# EAGLE design AC_nest (EAGLE 8.7.0)
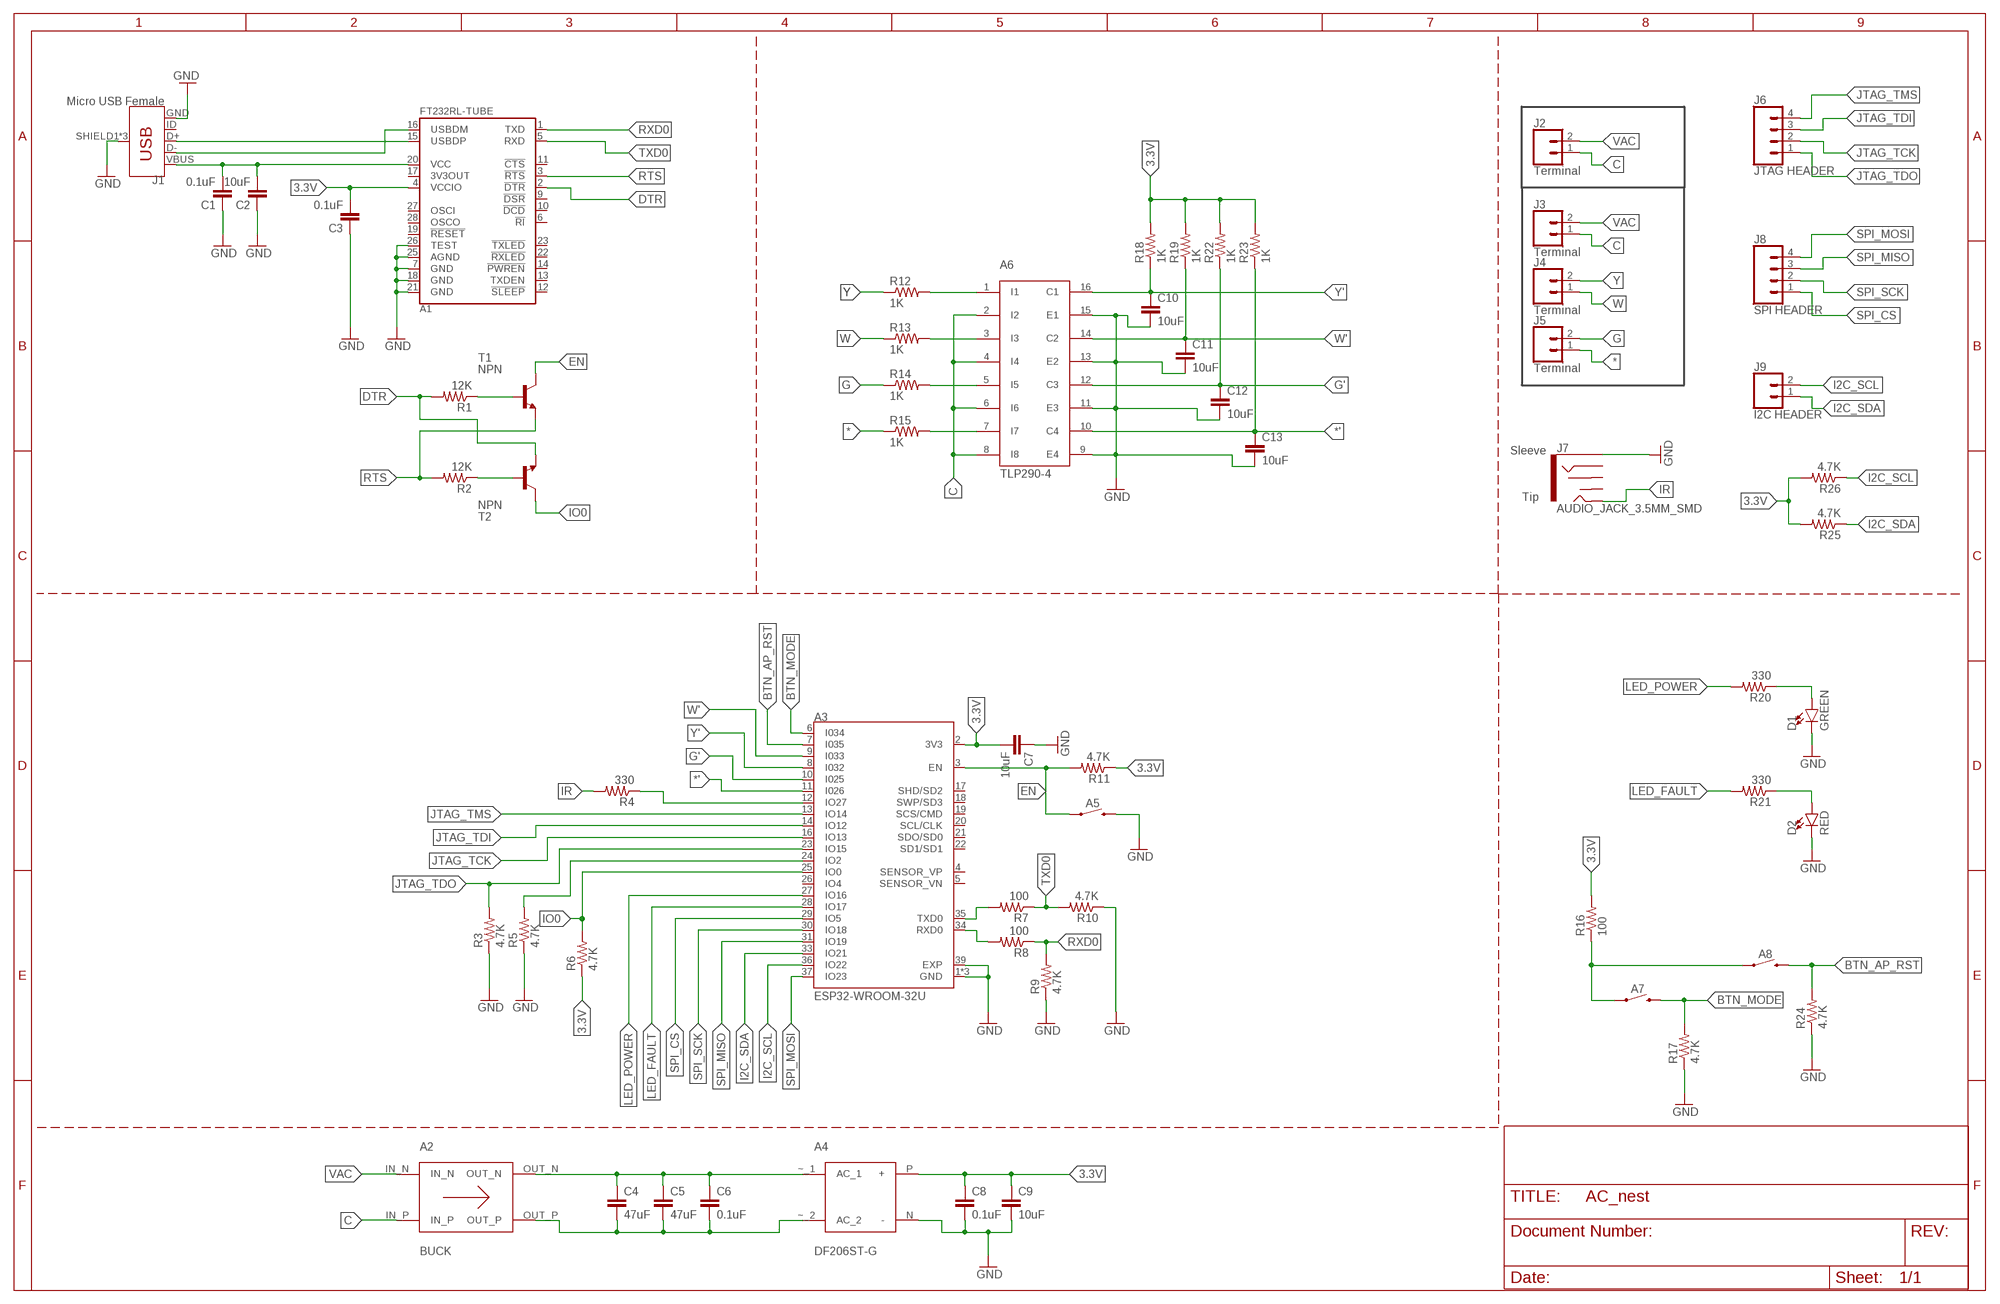
[diagram p0: schematic, sheet 1]

## Parts
A1  FT232RL  [SSOP28-LD]
A2  BUCK  [BUCK]
A3  ESP32-WROOM-32U  [XCVR_ESP32-WROOM-32U]
A4  DF206ST-G  [DF206ST-G]
A5  TL3302AF180QJ  [TL3302AF180QJ]
A6  TLP290-4  [TLP290-4]
A7  TL3302AF180QJ  [TL3302AF180QJ]
A8  TL3302AF180QJ  [TL3302AF180QJ]
C1  0.1uF  C-EUC0603  [C0603]
C2  10uF  C-EUC0603  [C0603]
C3  0.1uF  C-EUC0603  [C0603]
C4  47uF  C-EUC0603  [C0603]
C5  47uF  C-EUC0603  [C0603]
C6  0.1uF  C-EUC0603  [C0603]
C7  10uF  C-EUC0603  [C0603]
C8  0.1uF  C-EUC0603  [C0603]
C9  10uF  C-EUC0603  [C0603]
C10  10uF  C-EUC0603  [C0603]
C11  10uF  C-EUC0603  [C0603]
C12  10uF  C-EUC0603  [C0603]
C13  10uF  C-EUC0603  [C0603]
D1  GREEN  LED-GREEN0603  [LED-0603]
D2  RED  LED-RED0603  [LED-0603]
J1  Micro USB Female  USB_MICRO-B_FEMALE-SMT  [USB-B-MICRO-SMD]
J2  Terminal  CONN_023.5MM  [SCREWTERMINAL-3.5MM-2]
J3  Terminal  CONN_023.5MM  [SCREWTERMINAL-3.5MM-2]
J4  Terminal  CONN_023.5MM  [SCREWTERMINAL-3.5MM-2]
J5  Terminal  CONN_023.5MM  [SCREWTERMINAL-3.5MM-2]
J6  JTAG HEADER  CONN_04  [1X04]
J7  AUDIO_JACK_3.5MM_SMD  [AUDIO-JACK-3.5MM-SMD]
J8  SPI HEADER  CONN_04  [1X04]
J9  I2C HEADER  CONN_02  [1X02]
R1  12K  R-US_R0603  [R0603]
R2  12K  R-US_R0603  [R0603]
R3  4.7K  R-US_R0603  [R0603]
R4  330  R-US_R0603  [R0603]
R5  4.7K  R-US_R0603  [R0603]
R6  4.7K  R-US_R0603  [R0603]
R7  100  R-US_R0603  [R0603]
R8  100  R-US_R0603  [R0603]
R9  4.7K  R-US_R0603  [R0603]
R10  4.7K  R-US_R0603  [R0603]
R11  4.7K  R-US_R0603  [R0603]
R12  1K  R-US_R0603  [R0603]
R13  1K  R-US_R0603  [R0603]
R14  1K  R-US_R0603  [R0603]
R15  1K  R-US_R0603  [R0603]
R16  100  R-US_R0603  [R0603]
R17  4.7K  R-US_R0603  [R0603]
R18  1K  R-US_R0603  [R0603]
R19  1K  R-US_R0603  [R0603]
R20  330  R-US_R0603  [R0603]
R21  330  R-US_R0603  [R0603]
R22  1K  R-US_R0603  [R0603]
R23  1K  R-US_R0603  [R0603]
R24  4.7K  R-US_R0603  [R0603]
R25  4.7K  R-US_R0603  [R0603]
R26  4.7K  R-US_R0603  [R0603]
T1  NPN  -NPN-SOT23-EBC  [SOT23-EBC]
T2  NPN  -NPN-SOT23-EBC  [SOT23-EBC]

## Nets
3.3V: A1.4(VCCIO) A3.2(3V3) A4.P(+) C3.2 C7.2 C8.1 C9.1 R6.1 R11.1 R16.2 R18.2 R19.2 R22.2 R23.2 R25.2 R26.2
*: J5.1 R15.1
*': A3.11(I026) A6.10(C4) C13.1 R23.1
BTN_AP_RST: A3.7(I035) A8.2 R24.2
BTN_MODE: A3.6(I034) A7.2 R17.2
C: A2.IN_P A6.2(I2) A6.4(I4) A6.6(I6) A6.8(I8) J2.1 J3.1
DTR: A1.2(!DTR) R1.2 T2.E
EN: A3.3(EN) A5.1 R11.2 T1.C
G: J5.2 R14.1
G': A3.10(I025) A6.12(C3) C12.1 R22.1
GND: A1.7(GND) A1.18(GND) A1.21(GND) A1.25(AGND) A1.26(TEST) A3.1(GND) A3.15(GND) A3.38(GND) A3.39(EXP) A4.N(-) A5.2 A6.9(E4) A6.11(E3) A6.13(E2) A6.15(E1) C1.1 C2.1 C3.1 C7.1 C8.2 C9.2 C10.2 C11.2 C12.2 C13.2 D1.C D2.C J1.GND J1.SHIELD1(SHIELD) J1.SHIELD2(SHIELD) J1.SHIELD3(SHIELD) J7.SLEEVE R3.1 R5.1 R9.1 R10.1 R17.1 R24.1
I2C_SCL: A3.36(IO22) J9.2 R26.1
I2C_SDA: A3.33(IO21) J9.1 R25.1
IO0: A3.25(IO0) R6.2 T2.C
IR: J7.TIP R4.2
JTAG_TCK: A3.16(IO13) J6.2
JTAG_TDI: A3.14(IO12) J6.3
JTAG_TDO: A3.23(IO15) J6.1 R3.2
JTAG_TMS: A3.13(IO14) J6.4
LED_FAULT: A3.28(IO17) R21.2
LED_POWER: A3.27(IO16) R20.2
N$1: A6.1(I1) R12.2
N$2: A6.3(I3) R13.2
N$3: A6.5(I5) R14.2
N$4: A6.7(I7) R15.2
N$5: A3.34(RXD0) R8.2
N$6: A3.24(IO2) R5.2
N$7: A3.12(IO27) R4.1
N$8: A1.15(USBDP) J1.D+
N$10: A3.35(TXD0) R7.2
N$11: A1.16(USBDM) J1.D-
N$15: A2.OUT_N A4.~_1(AC_1) C4.1 C5.1 C6.1
N$16: R2.1 T2.B
N$17: A2.OUT_P A4.~_2(AC_2) C4.2 C5.2 C6.2
N$18: R1.1 T1.B
N$19: D1.A R20.1
N$21: D2.A R21.1
N$22: A7.1 A8.1 R16.1
RTS: A1.3(!RTS) R2.2 T1.E
RXD0: A1.1(TXD) R8.1 R9.2
SPI_CS: A3.29(IO5) J8.1
SPI_MISO: A3.31(IO19) J8.3
SPI_MOSI: A3.37(IO23) J8.4
SPI_SCK: A3.30(IO18) J8.2
TXD0: A1.5(RXD) R7.1 R10.2
USB_VBUS: A1.20(VCC) C1.2 C2.2 J1.VBUS
VAC: A2.IN_N J2.2 J3.2
W: J4.1 R13.1
W': A3.9(I033) A6.14(C2) C11.1 R19.1
Y: J4.2 R12.1
Y': A3.8(I032) A6.16(C1) C10.1 R18.1
Unconnected: A1.6(!RI) A1.9(!DSR) A1.10(!DCD) A1.11(!CTS) A1.12(!SLEEP) A1.13(TXDEN) A1.14(!PWREN) A1.19(!RESET) A1.22(!RXLED) A1.23(!TXLED) A1.27(OSCI) A1.28(OSCO) A3.4(SENSOR_VP) A3.5(SENSOR_VN) A3.17(SHD/SD2) A3.18(SWP/SD3) A3.19(SCS/CMD) A3.20(SCL/CLK) A3.21(SDO/SD0) A3.22(SD1/SD1) A3.26(IO4) J1.ID J7.RING J7.RSH J7.TSH

## Notes on the sheet
- Sleeve
- Tip

## Power pins joined to a net without a drawn wire
3V3OUT: A1.17(3V3OUT)

## Library data of the parts
A1 = AC_nest_parts:FT232RL; AVAILABILITY: Unavailable; DESCRIPTION: USB-to-UART 1-CH 256byte FIFO 5V 28-Pin SSOP Tube; MF: FTDI,; MP: FT232RL-TUBE; PACKAGE: SSOP-28 FTDI; PRICE: None
A2 = AC_nest_parts:BUCK
A3 = AC_nest_parts:ESP32-WROOM-32U: Wi-Fi/BT BLE Module ESP32-D0WD SPI Flash UART U.FL Conn.; AVAILABILITY: Unavailable; DESCRIPTION: Wi-Fi/BT BLE Module ESP32-D0WD SPI Flash UART U.FL Conn.; MF: Espressif Systems; MP: ESP32-WROOM-32U; PACKAGE: Module Espressif Systems; PRICE: None
A4 = AC_nest_parts:DF206ST-G
A5 A7 A8 = AC_nest_parts:TL3302AF180QJ
A6 = AC_nest_parts:TLP290-4: 4 Channel Optoisolator (AC/DC input)
C1-C13 = rcl:C-EU: CAPACITOR, European symbol; SPICEPREFIX: C
D1 = SparkFun-LED:LED-GREEN: Green SMD LED Used in manufacturing of various products at SparkFun Packages: 0603 - SMD 0603 package [Product Link] <http://www.futureelectronics.com/en/technologies/semiconductors/optoelectronics/leds/Pages/9894312-LTST-C190GKT.aspx?CrossPart=HSMG-C190&IM=0> LilyPad 1206 - SMD1206 LilyPad package [Product Link] <http://www.futureelectronics.com/en/Technologies/Product.aspx?ProductID=IN150NGHARVATEKCORPORATION2049943&IM=0> 1206 - SMD1206 package [Product Link] <http://www.futureelectronics.com/en/technologies/semiconductors/optoelectronics/leds/Pages/8315665-LTST-C150KGKT.aspx?IM=0> 1206 Bottom Mount -SMD 1206 Bottom Mount [Product Link] <http://www.digikey.com/product-detail/en/lite-on-inc/LTST-C230KGKT/160-1456-1-ND/386854> SparkFun Products: Pro Mini 328 -5V <https://www.sparkfun.com/products/821> RedBoard <https://www.sparkfun.com/products/12757> MP3 Trigger <https://www.sparkfun.com/products/13720> Makey Makey <https://www.sparkfun.com/products/11076>; PROD_ID: DIO-00821
D2 = SparkFun-LED:LED-RED: Red SMD LED Used in manufacturing of most products at SparkFun Packages: 0603 - SMD 0603 package [Product Link] <http://docs.avagotech.com/docs/AV02-0551EN> 0603 SMART - SMD 0603 SMART package ( more efficient and expensive)[Product Link] <http://www.osram-os.com/Graphics/XPic2/00077099_0.pdf> 1206 - SMD1206 package [Product Link] <https://www.sparkfun.com/datasheets/DevTools/LilyPad/Q150OVS4.pdff> SparkFun Products: Pro Mini 328 -5V <https://www.sparkfun.com/products/821> RedBoard <https://www.sparkfun.com/products/12757> IOIO-OTG <https://www.sparkfun.com/products/13613>; PROD_ID: DIO-00819
J1 = SparkFun-Connectors:USB_MICRO-B: USB Type Micro-B Connector Male/female and PTH/SMT variants SparkFun Products: SparkFun microB USB Breakout <https://www.sparkfun.com/products/12035> SparkFun USB microB Plug Breakout <https://www.sparkfun.com/products/10031> SparkFun ESP8266 Thing <https://www.sparkfun.com/products/13231>; PROD_ID: CONN-11752
J2-J5 = SparkFun-Connectors:CONN_02: Multi connection point. Often used as Generic Header-pin footprint for 0.1 inch spaced/style header connections On any of the 0.1 inch spaced packages, you can populate with these: Break Away Headers - Straight <https://www.sparkfun.com/products/116> (PRT-00116) Break Away Male Headers - Right Angle <https://www.sparkfun.com/products/553> (PRT-00553) Female Headers <https://www.sparkfun.com/products/115> (PRT-00115) Break Away Headers - Machine Pin <https://www.sparkfun.com/products/117> (PRT-00117) Break Away Female Headers - Swiss Machine Pin <https://www.sparkfun.com/products/743> (PRT-00743) For SCREWTERMINALS and SPRING TERMINALS visit here: Screw Terimnals on SparkFun.com <https://www.sparkfun.com/search/results?term=Screw+Terminals> (5mm/3.5mm/2.54mm spacing) This device is also useful as a general connection point to wire up your design to another part of your project. Our various solder wires solder well into these plated through hole pads. Hook-Up Wire - Assortment (Stranded, 22 AWG) <https://www.sparkfun.com/products/11375> (PRT-11375) Hook-Up Wire - Assortment (Solid Core, 22 AWG) <https://www.sparkfun.com/products/11367> (PRT-11367) View the entire wire category on our website here <https://www.sparkfun.com/categories/141> Special notes: Molex polarized connector foot print use with: PRT-08233 with associated crimp pins and housings. 2.54_SCREWTERM for use with PRT-10571. 3.5mm Screw Terminal footprints for PRT-08084 5mm Screw Terminal footprints for use with PRT-08432; PROD_ID: CONN-08399
J6 J8 = SparkFun-Connectors:CONN_04: Multi connection point. Often used as Generic Header-pin footprint for 0.1 inch spaced/style header connections On any of the 0.1 inch spaced packages, you can populate with these: Break Away Headers - Straight <https://www.sparkfun.com/products/116> (PRT-00116) Break Away Male Headers - Right Angle <https://www.sparkfun.com/products/553> (PRT-00553) Female Headers <https://www.sparkfun.com/products/115> (PRT-00115) Break Away Headers - Machine Pin <https://www.sparkfun.com/products/117> (PRT-00117) Break Away Female Headers - Swiss Machine Pin <https://www.sparkfun.com/products/743> (PRT-00743) For SCREWTERMINALS and SPRING TERMINALS visit here: Screw Terimnals on SparkFun.com <https://www.sparkfun.com/search/results?term=Screw+Terminals> (5mm/3.5mm/2.54mm spacing) This device is also useful as a general connection point to wire up your design to another part of your project. Our various solder wires solder well into these plated through hole pads. Hook-Up Wire - Assortment (Stranded, 22 AWG) <https://www.sparkfun.com/products/11375> (PRT-11375) Hook-Up Wire - Assortment (Solid Core, 22 AWG) <https://www.sparkfun.com/products/11367> (PRT-11367) View the entire wire category on our website here <https://www.sparkfun.com/categories/141> Special notes: Molex polarized connector foot print use with SKU : PRT-08231 with associated crimp pins and housings. 1MM SMD Version SKU: PRT-10208; PROD_ID: CONN-09696
J7 = SparkFun-Connectors:AUDIO_JACK_3.5MM: Audio Jack 3.5mm variants of PTH and SMT stereo audio jack with bypass switches. SparkFun Products: SparkFun SparkPunk Sound Kit <[https://www.sparkfun.com/products/11177]> - PTH MP3 Trigger <https://www.sparkfun.com/products/13720> -3.5mm SMD SparkFun PicoBoard <https://www.sparkfun.com/products/11888>- 2.5mm SMD; PROD_ID: CONN-10353
J9 = SparkFun-Connectors:CONN_02: Multi connection point. Often used as Generic Header-pin footprint for 0.1 inch spaced/style header connections On any of the 0.1 inch spaced packages, you can populate with these: Break Away Headers - Straight <https://www.sparkfun.com/products/116> (PRT-00116) Break Away Male Headers - Right Angle <https://www.sparkfun.com/products/553> (PRT-00553) Female Headers <https://www.sparkfun.com/products/115> (PRT-00115) Break Away Headers - Machine Pin <https://www.sparkfun.com/products/117> (PRT-00117) Break Away Female Headers - Swiss Machine Pin <https://www.sparkfun.com/products/743> (PRT-00743) For SCREWTERMINALS and SPRING TERMINALS visit here: Screw Terimnals on SparkFun.com <https://www.sparkfun.com/search/results?term=Screw+Terminals> (5mm/3.5mm/2.54mm spacing) This device is also useful as a general connection point to wire up your design to another part of your project. Our various solder wires solder well into these plated through hole pads. Hook-Up Wire - Assortment (Stranded, 22 AWG) <https://www.sparkfun.com/products/11375> (PRT-11375) Hook-Up Wire - Assortment (Solid Core, 22 AWG) <https://www.sparkfun.com/products/11367> (PRT-11367) View the entire wire category on our website here <https://www.sparkfun.com/categories/141> Special notes: Molex polarized connector foot print use with: PRT-08233 with associated crimp pins and housings. 2.54_SCREWTERM for use with PRT-10571. 3.5mm Screw Terminal footprints for PRT-08084 5mm Screw Terminal footprints for use with PRT-08432
R1-R26 = rcl:R-US_: RESISTOR, American symbol; SPICEPREFIX: R
T1 T2 = transistor:*-NPN-: NPN Transistror BF959 corrected 2008.03.06

## Board
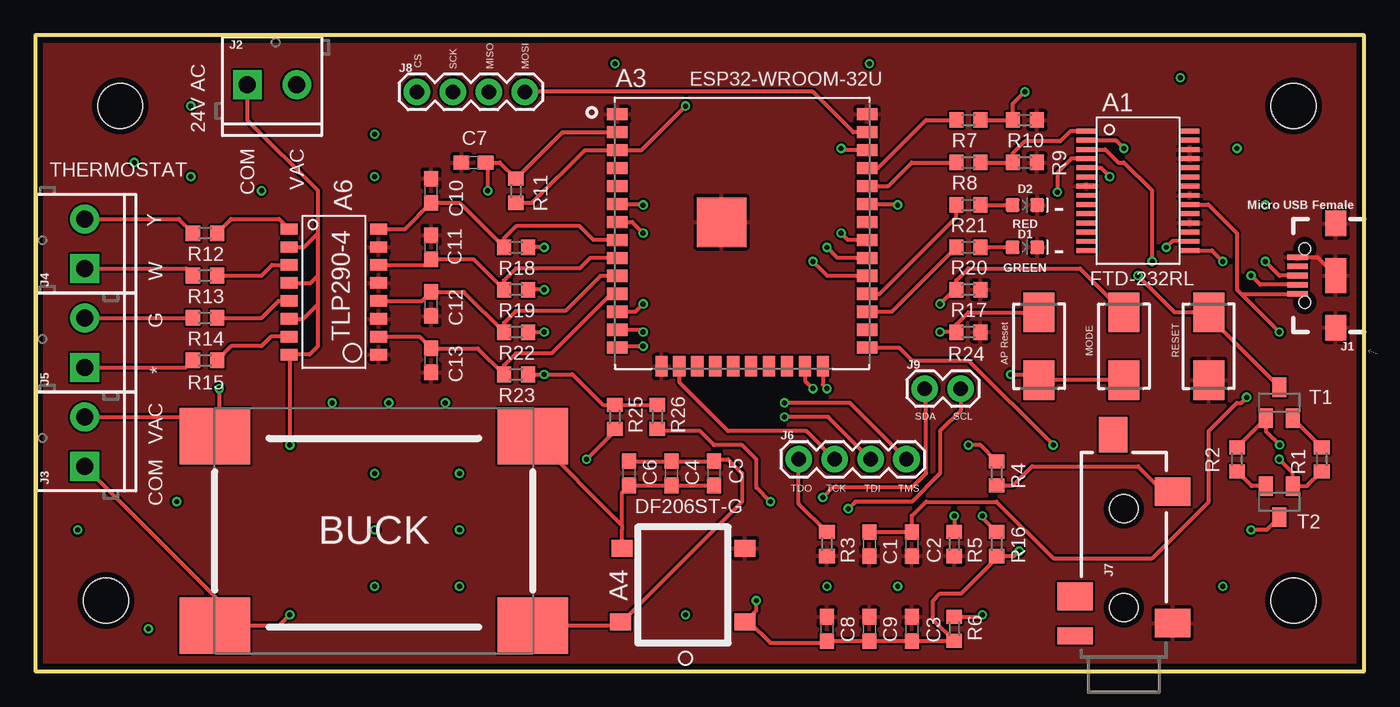
[diagram p1: board, top side]
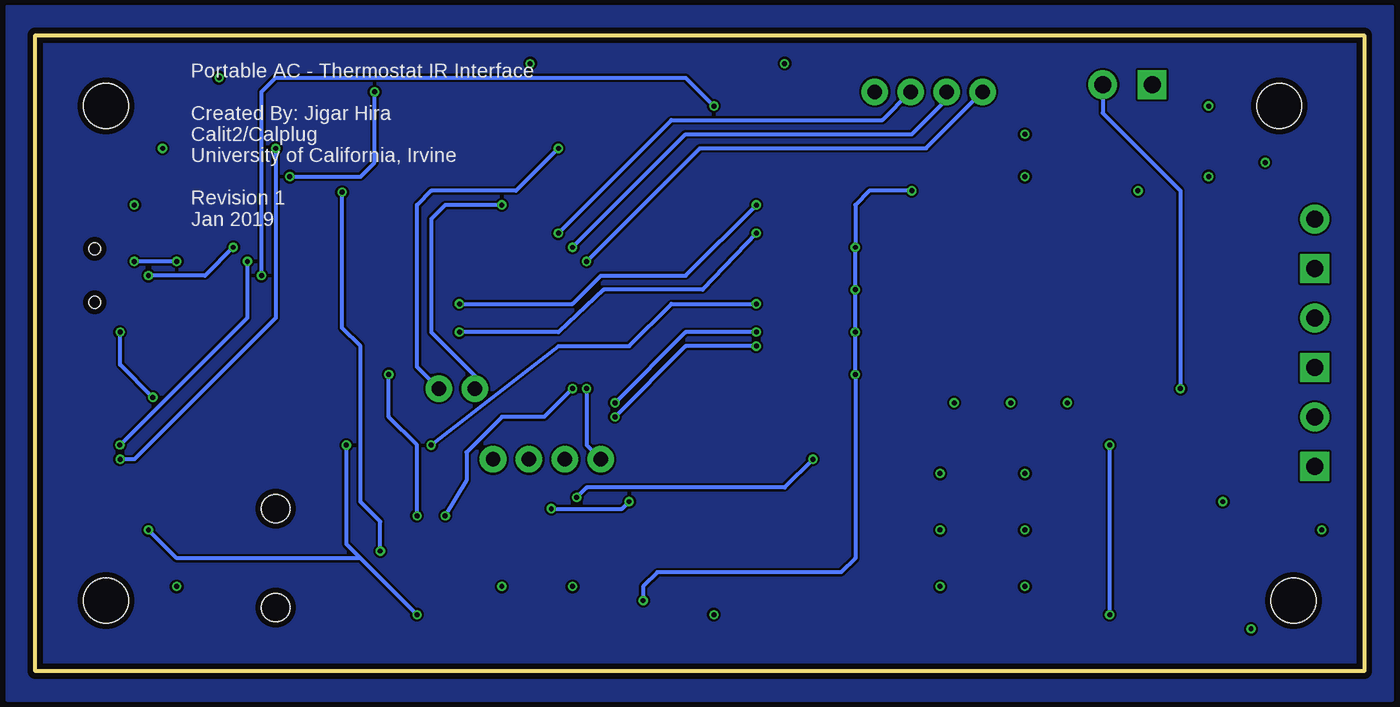
[diagram p2: board, bottom side, seen from below]

Size 94 x 45 mm. Coordinates in mm from the lower left corner, seen from the top.
Outline: 0,0 94,0 94,45 0,45 0,0
Copper layers (1*16): Top 0.035mm / dielectric 1.5mm / Bottom 0.035mm
Design rules "NOA Eagle Rule 2016-06-12": minimum track width 6mil, minimum drill 0.3mm, track to track 6mil, track to pad 6mil, pad to pad 6mil, via to via 6mil, smd to smd 0mil, copper to edge 0.4mm, drill to drill 10mil, minimum pad ring 10mil, minimum via ring 6mil, stop-mask expansion 2mil, vias tented up to drill 25mil, thermal gap 10mil
Holes 3.17 mm at 6,40 89,40 89,5 5,5

### Footprints (pad centres in the part's own frame; a part is rotated, then mirrored left to right if it is on the bottom)
SSOP28-LD = smd 0.348 x 1.397: 1 -4.225,-3.656; 2 -3.575,-3.656; 3 -2.925,-3.656; 4 -2.275,-3.656; 5 -1.625,-3.656; 6 -0.975,-3.656; 7 -0.325,-3.656; 8 0.325,-3.656; 9 0.975,-3.656; 10 1.625,-3.656; 11 2.275,-3.656; 12 2.925,-3.656; 13 3.575,-3.656; 14 4.225,-3.656; 15 4.225,3.656; 16 3.575,3.656; 17 2.925,3.656; 18 2.275,3.656; 19 1.625,3.656; 20 0.975,3.656; 21 0.325,3.656; 22 -0.325,3.656; 23 -0.975,3.656; 24 -1.625,3.656; 25 -2.275,3.656; 26 -2.925,3.656; 27 -3.575,3.656; 28 -4.225,3.656
BUCK = smd 5 x 4: IN_N -11.303,6.637; IN_P -11.303,-6.763; OUT_N 11.197,6.637; OUT_P 11.197,-6.763
XCVR_ESP32-WROOM-32U = smd 1.45 x 0.86: 1 -8.83,8.41; 2 -8.83,7.14; 3 -8.83,5.87; 4 -8.83,4.6; 5 -8.83,3.33; 6 -8.83,2.06; 7 -8.83,0.79; 8 -8.83,-0.48; 9 -8.83,-1.75; 10 -8.83,-3.02; 11 -8.83,-4.29; 12 -8.83,-5.56; 13 -8.83,-6.83; 14 -8.83,-8.1; 25 8.83,-8.1; 26 8.83,-6.83; 27 8.83,-5.56; 28 8.83,-4.29; 29 8.83,-3.02; 30 8.83,-1.75; 31 8.83,-0.48; 32 8.83,0.79; 33 8.83,2.06; 34 8.83,3.33; 35 8.83,4.6; 36 8.83,5.87; 37 8.83,7.14; 38 8.83,8.41 | smd 0.86 x 1.45: 15 -5.715,-9.43; 16 -4.445,-9.43; 17 -3.175,-9.43; 18 -1.905,-9.43; 19 -0.635,-9.43; 20 0.635,-9.43; 21 1.905,-9.43; 22 3.175,-9.43; 23 4.445,-9.43; 24 5.715,-9.43 | smd 3.5 x 3.5: 39 -1.46,0.77
DF206ST-G = smd 1.2 x 1.5: N -2.7,4.2; P 2.5,4.2; ~_1 -2.7,-4.5; ~_2 2.5,-4.6
TL3302AF180QJ = smd 2.8 x 2.2: 1 -2.4,0; 2 2.4,0
TLP290-4 = smd 0.8 x 1.2: 1 0,-7.62; 2 1.27,-7.62; 3 2.54,-7.62; 4 3.81,-7.62; 5 5.08,-7.62; 6 6.35,-7.62; 7 7.62,-7.62; 8 8.89,-7.62; 9 8.89,-1.27; 10 7.62,-1.27; 11 6.35,-1.27; 12 5.08,-1.27; 13 3.81,-1.27; 14 2.54,-1.27; 15 1.27,-1.27; 16 0,-1.27
C0603 = smd 1.1 x 1: 1 -0.85,0; 2 0.85,0
LED-0603 = smd 1 x 1: A -0.877,0; C 0.877,0
USB-B-MICRO-SMD = smd 1.45 x 0.4: D+ 2.725,0; D- 2.725,0.65; GND 2.725,-1.3; ID 2.725,-0.65; VBUS 2.725,1.3 | smd 1.5 x 1.8: SHIELD1 0,3.685; SHIELD2 0,-3.685 | smd 1.5 x 2.5: SHIELD3 0,0 | hole 0.85: 2.2,1.9; 2.2,-1.9
SCREWTERMINAL-3.5MM-2 = drill 1.2 pad 2.032 square: 1 0,0 | drill 1.2 pad 2.032: 2 3.5,0
1X04 = drill 1.016 pad 1.88: 1 0,0; 2 2.54,0; 3 5.08,0; 4 7.62,0
AUDIO-JACK-3.5MM-SMD = smd 2 x 2.5: RING 4.3,3.45; SLEEVE 2.4,-3.45; TIP 11.7,-3.45 | smd 1.2 x 2.5: RSH 1.5,3.45 | smd 2.5 x 2: TSH 15.75,0.75 | hole 2: 3.5,0; 10.5,0
1X02 = drill 1.016 pad 1.88: 1 0,0; 2 2.54,0
R0603 = smd 1 x 1.1: 1 -0.85,0; 2 0.85,0
SOT23-EBC = smd 1 x 1.4: B 0.95,-1.1; C 0,1.1; E -0.95,-1.1

### Placement (x,y rotation side)
A1  78,34 270 top
A2  24,10 0 top
A3  50,31 0 top
A4  46,6 270 top
A5  83,23 270 top
A6  25.56,31.29 270 top
A7  77,23 90 top
A8  71,23 90 top
C1  59,9 90 top
C2  62,9 90 top
C3  62,3 270 top
C4  45,14 90 top
C5  48,14 90 top
C6  42,14 90 top
C7  31,36 0 top
C8  56,3 90 top
C9  59,3 90 top
C10  28,34 90 top
C11  28,30 90 top
C12  28,26 270 top
C13  28,22 270 top
D1  70,30 0 top
D2  70,33 0 top
J1  92,28 180 top
J2  15,41.5 0 top
J3  3.5,14.5 90 top
J4  3.5,28.5 90 top
J5  3.5,21.5 90 top
J6  54,15 0 top
J7  77,1 90 top
J8  27,41 0 top
J9  62.92,20 0 top
R1  91,15 270 top
R2  85,15 90 top
R3  56,9 90 top
R4  68,14 270 top
R5  65,9 90 top
R6  65,3 90 top
R7  66,39 180 top
R8  66,36 180 top
R9  70,36 180 top
R10  70,39 180 top
R11  34,34 270 top
R12  12,31 0 top
R13  12,28 0 top
R14  12,25 0 top
R15  12,22 0 top
R16  68,9 270 top
R17  66,27 180 top
R18  34,30 0 top
R19  34,27 0 top
R20  66,30 180 top
R21  66,33 180 top
R22  34,24 0 top
R23  34,21 0 top
R24  66,24 180 top
R25  41,18 90 top
R26  44,18 90 top
T1  88,19 0 top
T2  88,12 180 top

### Tracks (layer width: path | path; a pad name or v marks a point on that pad's centre or on a via)
3.3V  (via drill 0.35)
  Top 0.3: A3.2 37.29,38.14 R11.1 32.85,36 C7.2 32,35.85 v32,34 | 34.87,24.02 R22.2 v36,24 | R23.2 v36,21 38,21 40.15,18.85 R25.2 R26.2 | v36,27 R19.2 | v36,30 R18.2 | v51,5 51,4.3 A4.P 50.5,3.5 52,2 55.85,2 C8.1 C9.1 C3.2 R6.1 63.5,3.65 63.5,5 64,5.5 65.5,5.5 68,8 R16.2 69.25,8.15 v69.6,8.5 | A1.4 73.28,36.27 72.3,35.3 v72.3,33.9
  Bottom 0.3: v32,34 35,34 36,33 v36,30 v36,27 v36,24 v36,21 36,8 37,7 50,7 51,6 v51,5 | v69.6,8.5 69.6,10.6 71,12 71,23 72.3,24.3 v72.3,33.9
*
  Top 0.3: J5.1 10.65,21.5 R15.1
*'
  Top 0.3: A6.10 27.18,23.67 C13.1 31.3,22.85 R23.1 33.15,21.65 34,22.5 36.5,22.5 40.71,26.71 A3.11
BTN_AP_RST  (via drill 0.35)
  Top 0.3: A8.2 66,25.4 65.15,24.55 R24.2 v64,24 | A3.7 42.21,31.79 v43,31
  Bottom 0.3: v43,31 46.8,27 53.8,27 57,24 v64,24
BTN_MODE  (via drill 0.35)
  Top 0.3: A7.2 73.9,28.5 66,28.5 65.15,27.65 R17.2 65,27 v64,26 | A3.6 42.94,33.06 v43,33
  Bottom 0.3: v64,26 56,26 54,28 48,28 v43,33
C  (via drill 0.35)
  Top 0.3: J2.1 15,39 20,34 20,31 | 20,26 20,23 19.4,22.4 A6.8 18,22.34 v18,16 | 20,26 20,28 | 20,28 20,31 | A6.6 18.94,24.94 20,26 | A6.4 19.48,27.48 20,28 | A6.2 19.02,30.02 20,31 | v18,4 17.24,3.24 A2.IN_P 13,3.54 13,5 J3.1
  Bottom 0.3: v18,4 v18,16
DTR  (via drill 0.35)
  Top 0.3: R1.2 89.95,13.1 T2.E 88.95,14.05 v88,15 | A1.2 76.42,37.58 v77,37
  Bottom 0.3: v77,37 77,25 87,15 v88,15
EN  (via drill 0.35)
  Top 0.3: R11.2 35.15,33.15 38.87,36.87 A3.3 42.87,36.87 v46,40 | T1.C 83,25.1 A5.1 80.6,25.4 v78,28
  Bottom 0.3: v46,40 48,42 70,42 77,42 78,41 v78,28
G
  Top 0.3: J5.2 R14.1
G'
  Top 0.3: A6.12 27.36,26.21 C12.1 30.3,26.85 R22.1 33.15,24.65 34,25.5 37.5,25.5 39.98,27.98 A3.10
GND
  Top 0.3: J1.GND 90.7,29.3 J1.SHIELD3
  pour Top: -1,46 95,46 95,-1 -1,-1
  pour Bottom: -2,47 96,47 96,-1 96,-2 -2,-2
I2C_SCL  (via drill 0.35)
  Top 0.3: 58.96,37 A3.36 57.13,36.87 v57,37 | J9.2 65.46,18.46 64,17 64,14 62,12 58,12 v57.5,11.5 | v52,12 51,13 51,15 50,16 48,16 47,17 44.15,17 R26.1
  Bottom 0.3: J9.2 67,21.54 67,33 66,34 60,34 v57,37 | v57.5,11.5 52.5,11.5 v52,12
I2C_SDA  (via drill 0.35)
  Top 0.3: A3.33 60.94,33.06 v61,33 | R25.1 41,17 v39,15 | J9.1 63,19.92 63,14 62,13 56.4,13 v55.7,12.3
  Bottom 0.3: v61,33 65,33 66,32 66,24 62.92,20.92 J9.1 | v39,15 41,13 55,13 v55.7,12.3
IO0  (via drill 0.35)
  Top 0.3: R6.2 66.85,3.85 v67,4 | T2.C 87.1,10 v86,10 | A3.25 61.1,22.9 62,22 66,22 v72,16
  Bottom 0.3: v67,4 71,8 | 71,8 84,8 v86,10 | v72,16 72,9 71,8
IR
  Top 0.3: R4.2 69.15,13.15 70.5,14.5 78,14.5 79.8,12.7 J7.TIP
JTAG_TCK
  Top 0.3: J6.2 54.54,17 49,17 45.55,20.45 A3.16
JTAG_TDI  (via drill 0.35)
  Top 0.3: J6.3 56.08,18 v53,18 | A3.14 41.27,23 v43,23
  Bottom 0.3: v43,23 48,23 v53,18
JTAG_TDO  (via drill 0.35)
  Top 0.3: R3.2 54,11.85 J6.1 | A3.23 54.45,20.55 v55,20
  Bottom 0.3: v55,20 55,16 J6.1
JTAG_TMS  (via drill 0.35)
  Top 0.3: J6.4 57.62,19 v53,19 | A3.13 42.83,24.17 v43,24
  Bottom 0.3: v43,24 48,24 v53,19
LED_FAULT
  Top 0.3: A3.28 59.71,26.71 65.15,32.15 R21.2
LED_POWER
  Top 0.3: A3.27 60.59,25.44 R20.2
N$1
  Top 0.3: R12.2 13.85,32 17.23,32 A6.1
N$2
  Top 0.3: R13.2 16,28 16.75,28.75 A6.3
N$3
  Top 0.3: R14.2 16,25 17.21,26.21 A6.5
N$4
  Top 0.3: R15.2 13.85,23 16,23 16.67,23.67 A6.7
N$5
  Top 0.3: A3.34 60.33,34.33 62,36 R8.2
N$6  (via drill 0.35)
  Top 0.3: A3.24 55.72,20.29 v56,20 | v65,11 R5.2
  Bottom 0.3: v56,20 58,18 61,18 63.5,15.5 63.5,13.5 v65,11
N$7  (via drill 0.35)
  Top 0.3: A3.12 42.44,25.44 v43,26 | R4.1 66.85,16 v66,16
  Bottom 0.3: v66,16 57,23 52,23 49,26 v43,26
N$8  (via drill 0.35)
  Top 0.3: J1.D+ 88,28 v87,29 | A1.15 83.22,29.77 v84,29
  Bottom 0.3: v84,29 v87,29
N$9  (via drill 0.35)
  other vias: 24,14
N$10
  Top 0.3: A3.35 59.6,35.6 63,39 R7.2
N$11  (via drill 0.35)
  Top 0.3: J1.D- 86.65,27.35 v86,28 | A1.16 80.42,30.43 v80,30
  Bottom 0.3: v80,30 82,28 v86,28
N$12  (via drill 0.35)
  other vias: 30,14
N$13  (via drill 0.35)
  other vias: 30,6
N$14  (via drill 0.35)
  other vias: 24,6
N$15
  Top 0.3: C5.1 C4.1 C6.1 41.5,12.65 41.5,10.33 | A4.~_1 41.5,10 41.5,10.33 | A2.OUT_N 41.5,10.33
N$16
  Top 0.3: T2.B 86.05,13.1 R2.1
N$17
  Top 0.3: C6.2 C4.2 C5.2 48.15,15 49,15 50,14 50,12 41.5,3.5 A4.~_2 41.14,3.24 A2.OUT_P
N$18
  Top 0.3: R1.1 T1.B
N$19
  Top 0.3: R20.1 D1.A
N$20  (via drill 0.35)
  other vias: 30,10
N$21
  Top 0.3: R21.1 D2.A
N$22  (via drill 0.35)
  Top 0.3: A7.1 A8.1 70.6,21 v69,21 | R16.1 67,10.85 v67,11
  Bottom 0.3: v67,11 67,16 69,18 v69,21
N$23  (via drill 0.35)
  other vias: 24,10
N$24  (via drill 0.35)
  other vias: 87,33
N$25  (via drill 0.35)
  other vias: 85,37
N$26  (via drill 0.35)
  other vias: 81,42
N$27  (via drill 0.35)
  other vias: 84,6
N$28  (via drill 0.35)
  other vias: 3,10
N$29  (via drill 0.35)
  other vias: 10,12
N$30  (via drill 0.35)
  other vias: 8,3
N$31  (via drill 0.35)
  other vias: 11,35
N$32  (via drill 0.35)
  other vias: 11,40
N$33  (via drill 0.35)
  other vias: 7,36
N$34  (via drill 0.35)
  other vias: 21,19
N$35  (via drill 0.35)
  other vias: 25,19
N$36  (via drill 0.35)
  other vias: 29,19
N$37  (via drill 0.35)
  other vias: 24,38
N$38  (via drill 0.35)
  other vias: 24,35
N$39  (via drill 0.35)
  other vias: 16,34
N$40  (via drill 0.35)
  other vias: 41,43
N$41  (via drill 0.35)
  other vias: 59,43
N$42  (via drill 0.35)
  other vias: 56,6
N$43  (via drill 0.35)
  other vias: 61,6
N$44  (via drill 0.35)
  other vias: 46,4
RTS  (via drill 0.35)
  Top 0.3: R2.2 T1.E 87.05,16.98 v88.02,16.02 | v79,29 79,34 77,36 76.6,36 75.67,36.92 A1.3
  Bottom 0.3: v79,29 79,26.03 79,25 87.98,16.02 v88.02,16.02
RXD0
  Top 0.3: R8.1 R9.2 69.15,36.65 70,37.5 72.5,37.5 73.22,38.23 A1.1
SPI_CS  (via drill 0.35)
  Top 0.3: A3.29 56.02,27.98 v55,29
  Bottom 0.3: v55,29 47,37 31,37 J8.1
SPI_MISO  (via drill 0.35)
  Top 0.3: A3.31 57.48,30.52 v57,31
  Bottom 0.3: v57,31 49,39 34.08,39 J8.3
SPI_MOSI
  Top 0.3: A3.37 57.86,38.14 55,41 J8.4
SPI_SCK  (via drill 0.35)
  Top 0.3: A3.30 56.75,29.25 v56,30
  Bottom 0.3: v56,30 48,38 32,38 29.54,40.46 J8.2
TXD0  (via drill 0.35)
  Top 0.3: R7.1 R10.2 69.15,40.15 v70,41 | A1.5 75.38,35.62 v76,35
  Bottom 0.3: v76,35 71,35 70,36 v70,41
USB_VBUS  (via drill 0.35)
  Top 0.3: C1.2 C2.2 62,11 63,12 68,12 72,8 79,8 83,12 83,17 85,19 85.3,19 v85.68,19.38 | A1.20 82.97,33.02 85,31 85,27 85.3,26.7 | 85.3,26.7 J1.VBUS | v88,24 85.3,26.7
  Bottom 0.3: v85.68,19.38 88,21.7 v88,24
VAC  (via drill 0.35)
  Top 0.3: J3.2 11.33,18 A2.IN_N 13,16.94 v13,20
  Bottom 0.3: J2.2 18.5,39.5 13,34 v13,20
W
  Top 0.3: J4.1 10.65,28.5 R13.1
W'
  Top 0.3: A6.14 27.6,28.75 C11.1 31,29.15 R19.1 33.15,27.65 34,28.5 38.5,28.5 39.25,29.25 A3.9
Y
  Top 0.3: J4.2 10.15,32 R12.1
Y'
  Top 0.3: A6.16 26.14,31.29 C10.1 30,33.15 R18.1 33.15,30.65 34,31.5 38.5,31.5 39.48,30.52 A3.8

### Text on the board
tPlace: 24V AC | CS | SCK | MISO | MOSI | COM | VAC | THERMOSTAT | Y | - | W | - | FTD-232RL | G | * | AP Reset | MODE | RESET | VAC | SDA | SCL | COM | TDO | TCK | TDI | TMS | BUCK
bPlace: Portable AC - Thermostat IR Interface / / Created By: Jigar Hira / Calit2/Calplug / University of California, Irvine / / Revision 1 / Jan 2019